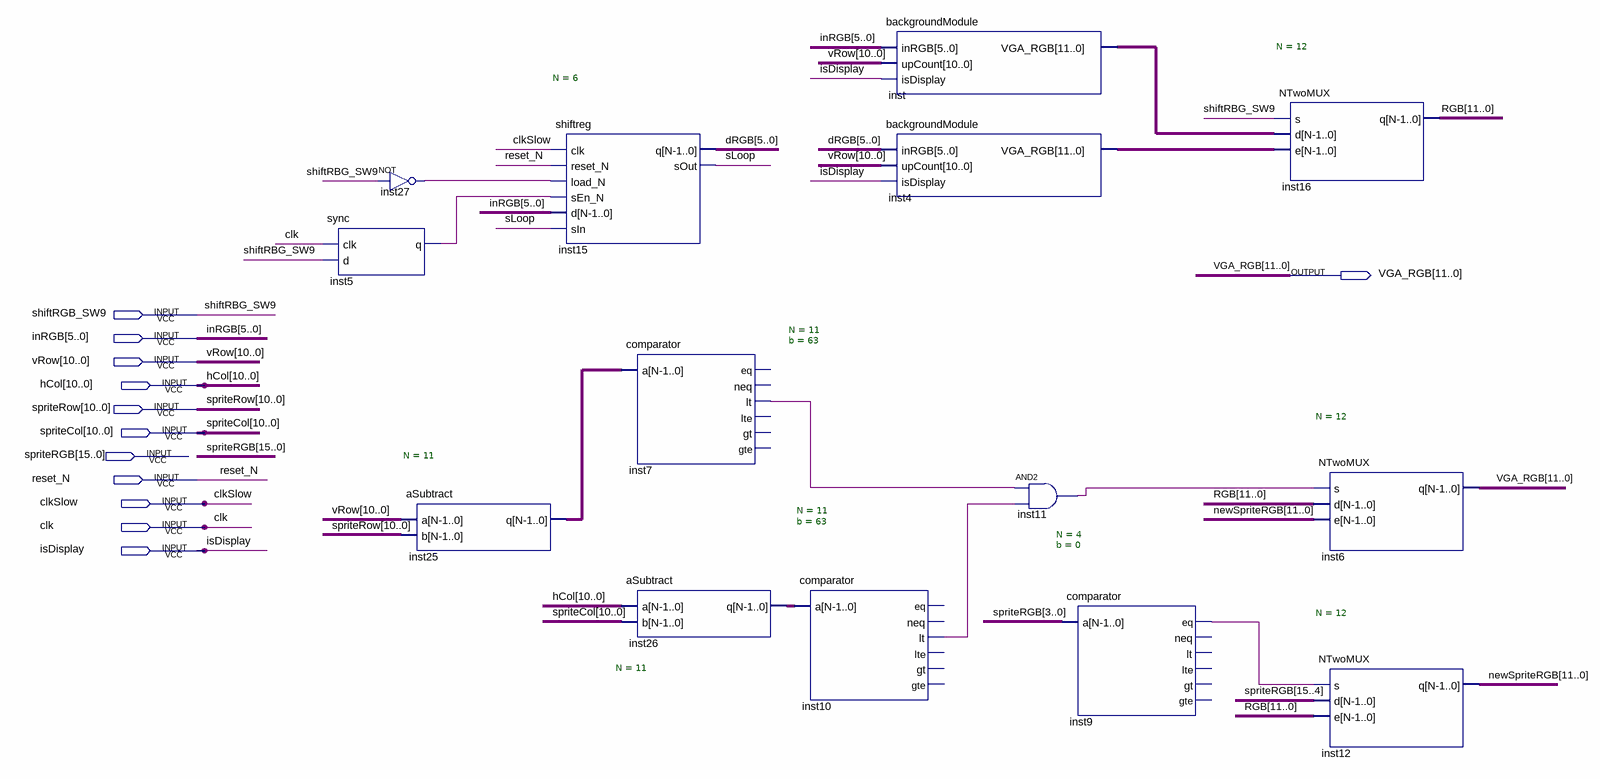
[diagram p0: schematic sheet]
// Quartus schematic newBackgroundModule.bdf as structural Verilog: 14 symbols, 12 pins
module newBackgroundModule (
  input  shiftRGB_SW9,
  input  [5:0] inRGB,
  input  [10:0] vRow,
  input  [10:0] hCol,
  input  [10:0] spriteRow,
  input  [10:0] spriteCol,
  input  [15:0] spriteRGB,
  input  reset_N,
  input  clkSlow,
  input  clk,
  input  isDisplay,
  output [11:0] VGA_RGB
);

  wire inst5_q, inst7_lt, inst9_eq, inst10_lt, inst11_out, inst27_out, sLoop;
  wire [5:0] dRGB;
  wire [10:0] inst25_q, inst26_q;
  wire [11:0] inst4_vga_rgb, inst_vga_rgb, newSpriteRGB, RGB;

  not inst27 (inst27_out, shiftRGB_SW9);
  sync inst5 (.clk(clk), .d(shiftRGB_SW9), .q(inst5_q));
  aSubtract #(.N(11)) inst25 (.a(vRow), .b(spriteRow), .q(inst25_q));
  shiftreg #(.N(6)) inst15 (
    .clk(clkSlow), .reset_N(reset_N), .load_N(inst27_out), .sEn_N(inst5_q), .sIn(sLoop), .d(inRGB), .q(dRGB),
    .sOut(sLoop));
  comparator #(.N(11), .b(63)) inst7 (.a(inst25_q), .lt(inst7_lt));  // open: eq, neq, lte, gt, gte
  aSubtract #(.N(11)) inst26 (.a(hCol), .b(spriteCol), .q(inst26_q));
  comparator #(.N(11), .b(63)) inst10 (.a(inst26_q), .lt(inst10_lt));  // open: eq, neq, lte, gt, gte
  backgroundModule inst (.inRGB(inRGB), .upCount(vRow), .isDisplay(isDisplay), .VGA_RGB(inst_vga_rgb));
  backgroundModule inst4 (.inRGB(dRGB), .upCount(vRow), .isDisplay(isDisplay), .VGA_RGB(inst4_vga_rgb));
  and inst11 (inst11_out, inst7_lt, inst10_lt);
  comparator #(.N(4), .b(0)) inst9 (.a(spriteRGB[3:0]), .eq(inst9_eq));  // open: neq, lt, lte, gt, gte
  NTwoMUX #(.N(12)) inst16 (.s(shiftRGB_SW9), .d(inst_vga_rgb), .e(inst4_vga_rgb), .q(RGB));
  NTwoMUX #(.N(12)) inst6 (.s(inst11_out), .d(RGB), .e(newSpriteRGB), .q(VGA_RGB));
  NTwoMUX #(.N(12)) inst12 (.s(inst9_eq), .d(spriteRGB[15:4]), .e(RGB), .q(newSpriteRGB));

  // Other names for the same wires on the sheet: shiftRBG_SW9 = shiftRGB_SW9
endmodule
